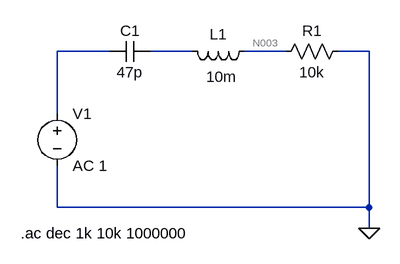
[diagram p0: schematic 2nd Order Resonant Circuit.asc]
2nd Order Resonant Circuit.asc, the LTspice schematic file:
Version 4
SHEET 1 880 680
WIRE 112 176 32 176
WIRE 240 176 176 176
WIRE 384 176 320 176
WIRE 512 176 464 176
WIRE 32 272 32 176
WIRE 32 416 32 352
WIRE 512 416 512 176
WIRE 512 416 32 416
WIRE 512 448 512 416
FLAG 512 448 0
SYMBOL cap 112 192 R270
WINDOW 0 32 32 VTop 2
WINDOW 3 0 32 VBottom 2
SYMATTR InstName C1
SYMATTR Value 47p
SYMBOL ind 336 160 R90
WINDOW 0 5 56 VBottom 2
WINDOW 3 39 51 VTop 2
SYMATTR InstName L1
SYMATTR Value 10m
SYMBOL res 480 160 R90
WINDOW 0 0 56 VBottom 2
WINDOW 3 32 56 VTop 2
SYMATTR InstName R1
SYMATTR Value 10k
SYMBOL voltage 32 256 R0
WINDOW 123 0 0 Left 0
WINDOW 39 0 0 Left 0
SYMATTR InstName V1
SYMATTR Value AC 1
TEXT -24 456 Left 2 !.ac dec 1k 10k 1000000

The netlist it stands for:
* 2nd Order Resonant Circuit.asc
C1 N001 N002 47p
L1 N003 N002 10m
R1 0 N003 10k
V1 N001 0 AC 1
.ac dec 1k 10k 1000000
.backanno
.end

* Results of the author's LTspice run, read from the files saved beside the schematic
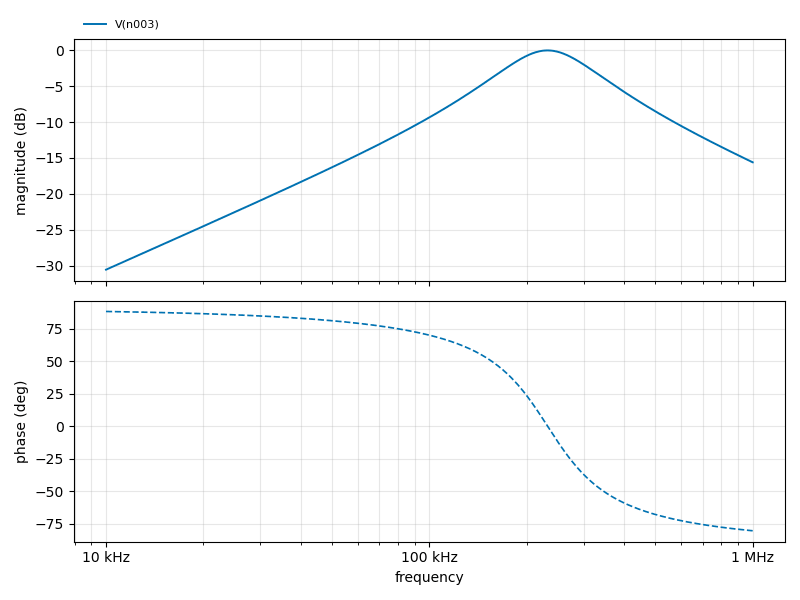
[diagram p1: AC Analysis of 2nd Order Resonant Circuit.asc, plotted from the saved traces]
* AC Analysis, 1 run:
*   V(n003): -30.58 dB at 10 kHz, -15.60 dB at 1 MHz, peak -0.00 dB at 232.3 kHz, 3 dB below the peak at 165.8 kHz and 325 kHz